# EAGLE design auto_resetter (EAGLE 7.3.0)
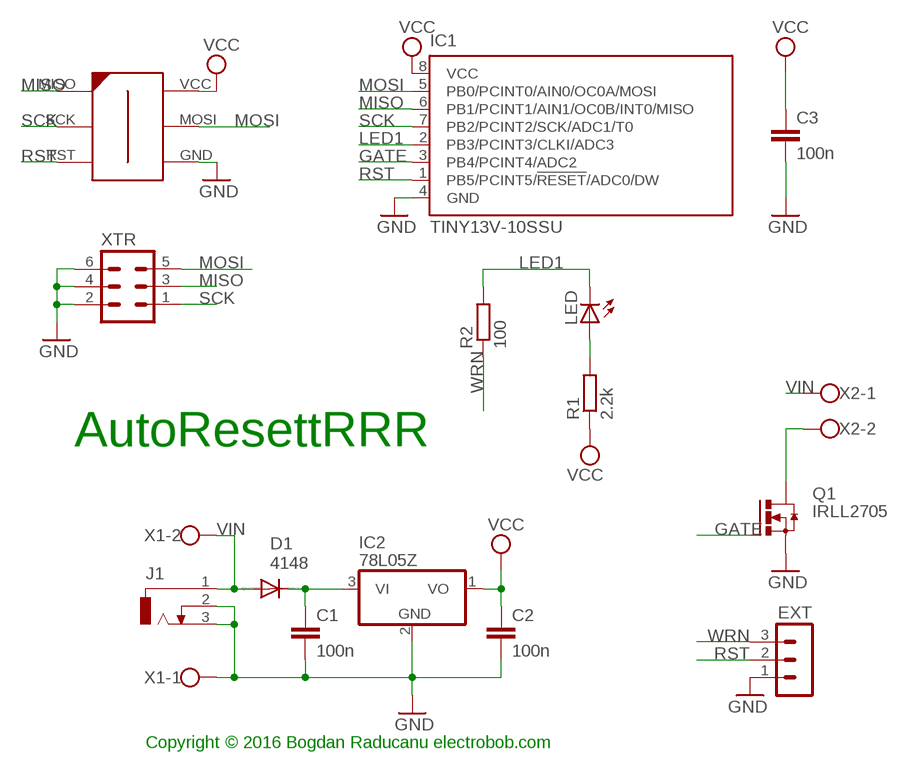
[diagram p0: schematic, sheet 1]

## Parts
C1  100n  C-EUC0805  [C0805]
C2  100n  C-EUC0805  [C0805]
C3  100n  C-EUC0805  [C0805]
D1  4148  DIODE-MINIMELF  [MINIMELF]
EXT  MA03-1  [MA03-1]
IC1  TINY13V-10SSU  [8S1]
IC2  78L05Z  [TO92]
J1  DCJ0303  [DCJ0303]
LED  LED3MM  [LED3MM]
Q1  IRLL2705  N-HEXFET-2D_SOT232-  [SOT223]
R1  2.2k  R-EU_M0805  [M0805]
R2  100  R-EU_M0805  [M0805]
U$1  AVR-ISP-6-EDGE  [6PAD_ISP]
X1  W237-102  [W237-102]
X2  W237-102  [W237-102]
XTR  MA03-2  [MA03-2]

## Nets
GATE: IC1.3(PB4/PCINT4/ADC2) Q1.1(G)
GND: C1.2 C2.2 C3.2 EXT.1 IC1.4(GND) IC2.2(GND) J1.2 J1.3 Q1.3(S) U$1.GND X1.1 XTR.2 XTR.4 XTR.6
LED1: IC1.2(PB3/PCINT3/CLKI/ADC3) LED.K(C) R2.2
MISO: IC1.6(PB1/PCINT1/AIN1/OC0B/INT0/MISO) U$1.MISO XTR.3
MOSI: IC1.5(PB0/PCINT0/AIN0/OC0A/MOSI) U$1.MOSI XTR.5
N$1: C1.1 D1.C IC2.3(VI)
N$2: LED.A R1.2
N$4: Q1.2(D) Q1.4(D) X2.2
RST: EXT.2 IC1.1(PB5/PCINT5/!RESET!/ADC0/DW) U$1.RST
SCK: IC1.7(PB2/PCINT2/SCK/ADC1/T0) U$1.SCK XTR.1
VCC: C2.1 C3.1 IC1.8(VCC) IC2.1(VO) R1.1 U$1.VCC
VIN: D1.A J1.1 X1.2 X2.1
WRN: EXT.3 R2.1

## Notes on the sheet
- AutoResettRRR
- Copyright © 2016 Bogdan Raducanu electrobob.com

## Library data of the parts
C1-C3 = rcl:C-EU: CAPACITOR, European symbol
D1 = diode:DIODE-: DIODE
EXT = con-lstb:MA03-1: PIN HEADER; OC_FARNELL: unknown; OC_NEWARK: unknown
IC1 = atmel:TINY13: 8-bit AVR Microcontroller with 1K Bytes In-System Programmable Flash Source: http://www.atmel.com/dyn/resources/prod_documents/2535S.pdf; MPN: ATTINY13V-10SSU; OC_FARNELL: 1455135; OC_NEWARK: 58M3773
IC2 = linear:78*: Positive VOLTAGE REGULATOR Source: http://cache.national.com/ds/LM/LM78L05.pdf http://www.fairchildsemi.com/ds/LM/LM7805.pdf
J1 = con-jack:DCJ0303: DC POWER JACK Source: DCJ0303.pdf; OC_FARNELL: unknown; OC_NEWARK: unknown
LED = led:LED: LED OSRAM: - CHIPLED LG R971, LG N971, LY N971, LG Q971, LY Q971, LO R971, LY R971 LH N974, LH R974 LS Q976, LO Q976, LY Q976 LO Q996 - Hyper CHIPLED LW Q18S LB Q993, LB Q99A, LB R99A - SideLED LS A670, LO A670, LY A670, LG A670, LP A670 LB A673, LV A673, LT A673, LW A673 LH A674 LY A675 LS A676, LA A676, LO A676, LY A676, LW A676 LS A679, LY A679, LG A679 - Hyper Micro SIDELED® LS Y876, LA Y876, LO Y876, LY Y876 LT Y87S - SmartLED LW L88C, LW L88S LB L89C, LB L89S, LG L890 LS L89K, LO L89K, LY L89K LS L896, LA L896, LO L896, LY L896 - TOPLED LS T670, LO T670, LY T670, LG T670, LP T670 LSG T670, LSP T670, LSY T670, LOP T670, LYG T670 LG T671, LOG T671, LSG T671 LB T673, LV T673, LT T673, LW T673 LH T674 LS T676, LA T676, LO T676, LY T676, LB T676, LH T676, LSB T676, LW T676 LB T67C, LV T67C, LT T67C, LS T67K, LO T67K, LY T67K, LW E67C LS E67B, LA E67B, LO E67B, LY E67B, LB E67C, LV E67C, LT E67C LW T67C LS T679, LY T679, LG T679 LS T770, LO T770, LY T770, LG T770, LP T770 LB T773, LV T773, LT T773, LW T773 LH T774 LS E675, LA E675, LY E675, LS T675 LS T776, LA T776, LO T776, LY T776, LB T776 LHGB T686 LT T68C, LB T68C - Hyper Mini TOPLED® LB M676 - Mini TOPLED Santana® LG M470 LS M47K, LO M47K, LY M47K Source: http://www.osram.convergy.de LUXEON: - LUMILED® LXK2-PW12-R00, LXK2-PW12-S00, LXK2-PW14-U00, LXK2-PW14-V00 LXK2-PM12-R00, LXK2-PM12-S00, LXK2-PM14-U00 LXK2-PE12-Q00, LXK2-PE12-R00, LXK2-PE12-S00, LXK2-PE14-T00, LXK2-PE14-U00 LXK2-PB12-K00, LXK2-PB12-L00, LXK2-PB12-M00, LXK2-PB14-N00, LXK2-PB14-P00, LXK2-PB14-Q00 LXK2-PR12-L00, LXK2-PR12-M00, LXK2-PR14-Q00, LXK2-PR14-R00 LXK2-PD12-Q00, LXK2-PD12-R00, LXK2-PD12-S00 LXK2-PH12-R00, LXK2-PH12-S00 LXK2-PL12-P00, LXK2-PL12-Q00, LXK2-PL12-R00 Source: www.luxeon.com KINGBRIGHT: KA-3528ASYC Source: www.kingbright.com
Q1 = transistor-power:N-HEXFET-2D_?-*: HEXFET® Power MOSFET 2 Drain connects http://www.irf.com/product-info/datasheets/data/irll014n.pdf
R1 R2 = rcl:R-EU_: RESISTOR, European symbol
U$1 = avr-7:AVR-ISP-6-EDGE: 6 pin edge connector for ISP with ATMEL MCUs. Developed by Craig Moates (craig at moates dot net). Library by David Blundell (blundar at gmail dot com). Often, even a 6 pin header is really inconvenient for board layout and/or production. This SMD-only header is our de-facto standard for using an edge connector for programming with the help of a 6pin/10pin to edge card adapter.
X1 X2 = con-wago-500:W237-102: WAGO SCREW CLAMP; MPN: 237-102; OC_FARNELL: unknown; OC_NEWARK: 70K9898
XTR = con-lstb:MA03-2: PIN HEADER; OC_FARNELL: unknown; OC_NEWARK: unknown

## Board
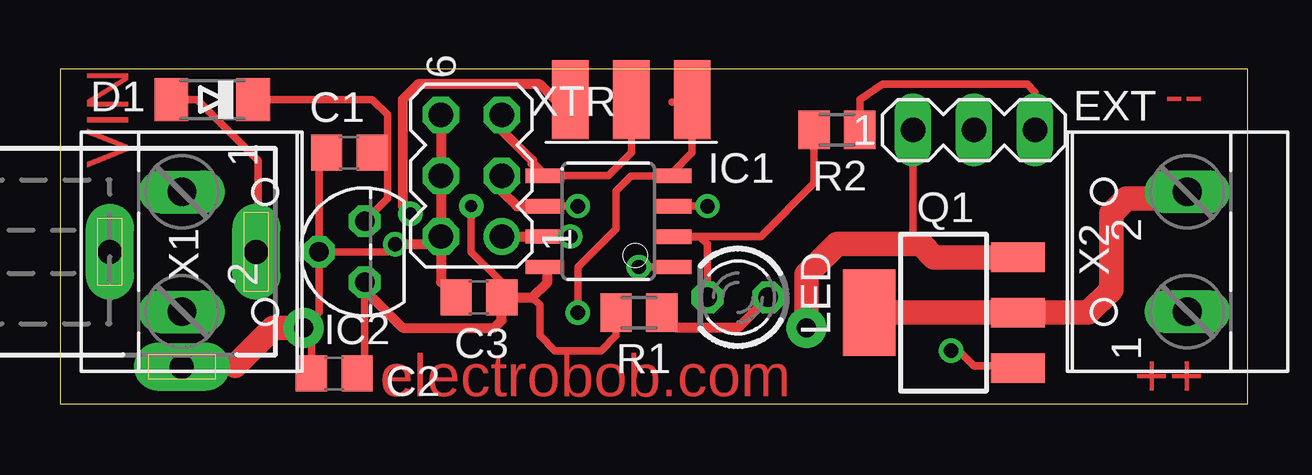
[diagram p1: board, top side]
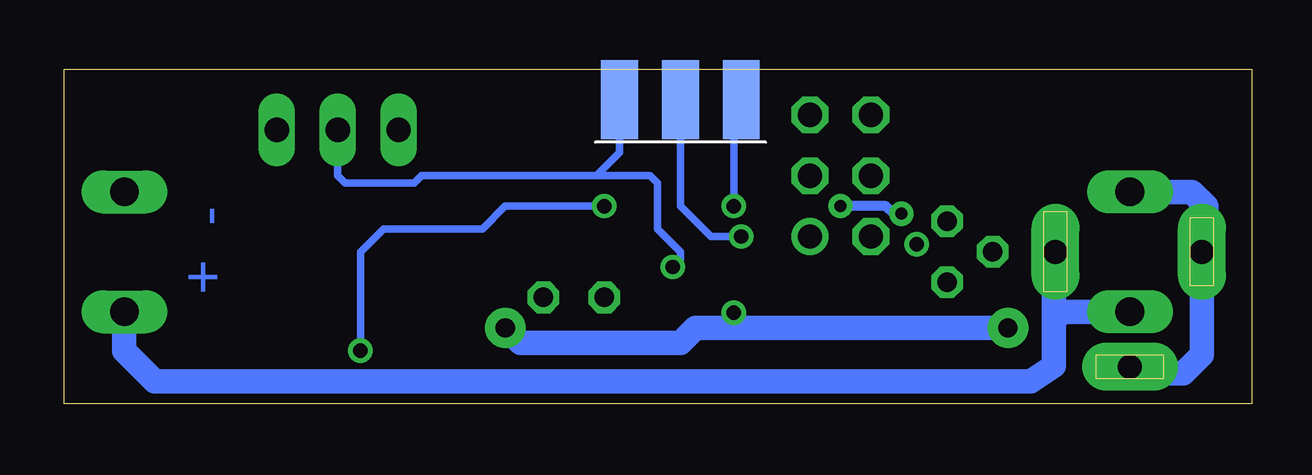
[diagram p2: board, bottom side, seen from below]

Size 49.5 x 13.96 mm. Coordinates in mm from the lower left corner, seen from the top.
Outline: 0,0 49.5,0 49.5,13.96 0,13.96 0,0
Copper layers (1*16): Top 0.035mm / dielectric 1.5mm / Bottom 0.035mm
Design rules "Elecrow_2-layer_eagle_rule": minimum track width 6mil, minimum drill 12mil, track to track 6mil, track to pad 6mil, pad to pad 6mil, via to via 6mil, smd to smd 0mil, copper to edge 10mil, drill to drill 10mil, minimum pad ring 10mil, minimum via ring 6mil, stop-mask expansion 2mil, vias tented up to drill 100mil, thermal gap 10mil

### Footprints (pad centres in the part's own frame; a part is rotated, then mirrored left to right if it is on the bottom)
C0805 = smd 1.3 x 1.5: 1 -0.95,0; 2 0.95,0
MINIMELF = smd 1.4 x 1.8: A 1.7,0; C -1.7,0
MA03-1 = drill 1.016 long: 1 -2.54,0; 2 0,0; 3 2.54,0
8S1 = smd 0.6 x 1.6: 1 -1.905,-2.654; 2 -0.645,-2.654; 3 0.625,-2.654; 4 1.895,-2.654; 5 1.905,2.654; 6 0.635,2.654; 7 -0.635,2.654; 8 -1.905,2.654
TO92 = drill 0.813 octagon: 1 -1.27,0; 2 0,1.905; 3 1.27,0
DCJ0303 = drill 1 pad 2 long: 1 0,3.1; 2 4.8,0; 3 0,-3
LED3MM = drill 0.813 octagon: A -1.27,0; K 1.27,0
SOT223 = smd 1.219 x 2.235: 1 -2.311,-3.099; 2 0,-3.099; 3 2.311,-3.099 | smd 3.6 x 2.2: 4 0,3.099
M0805 = smd 1.3 x 1.6: 1 -0.95,0; 2 0.95,0
6PAD_ISP = smd 1.524 x 3.302 bottom: GND 2.54,0; MOSI 0,0; VCC -2.54,0 | smd 1.524 x 3.302: MISO -2.54,0; RST 2.54,0; SCK 0,0
W237-102 = drill 1.194 long: 1 -2.5,-1.27; 2 2.5,-1.27
MA03-2 = drill 1.016: 1 -2.54,-1.27 | drill 1.016 octagon: 2 -2.54,1.27; 3 0,-1.27; 4 0,1.27; 5 2.54,-1.27; 6 2.54,1.27

### Placement (x,y rotation side)
C1  12.06,10.48 180 top
C2  11.43,1.27 180 top
C3  17.46,4.45 180 top
D1  6.35,12.7 180 top
EXT  38.1,11.43 0 top
IC1  22.86,7.62 90 top
IC2  12.7,6.35 90 top
J1  5.08,6.35 270 top
LED  28.26,4.45 180 top
Q1  36.83,3.81 90 top
R1  24.13,3.81 0 top
R2  32.38,11.43 180 top
U$1  23.81,12.7 180 bottom
X1  6.35,6.35 270 top
X2  45.72,6.35 90 top
XTR  17.14,9.53 90 top

### Tracks (layer width: path | path; a pad name or v marks a point on that pad's centre or on a via)
GATE  (via drill 0.6 pad 1.02)
  Top 0.305: v26.99,8.26 25.52,8.26 IC1.3 | v37.15,2.22 37.47,2.22 38.1,1.59 39.84,1.59 Q1.1
  Bottom 0.305: v26.99,8.26 31.11,8.26 32.07,7.3 36.2,7.3 37.15,6.35 v37.15,2.22
GND  (via drill 0.6 pad 1.02, 0.8 pad 1.68)
  Top 0.305: IC2.2 10.79,10.47 C1.2 | IC2.2 10.79,3.81 v10.16,3.17 10.48,2.85 C2.2 | IC2.2 13.65,6.35 v13.97,6.67 | 25.51,12.59 U$1.GND 26.35,10.48 25.51,9.64 IC1.4 23.8,9.52 23.18,8.89 23.18,7.3 21.59,5.71 v21.59,3.81 | EXT.1 35.56,6.99 35.88,6.67
  Top 0.406: XTR.6 XTR.4 XTR.2 | v13.97,6.67 15.56,6.67 XTR.2 | XTR.2 15.88,5.08 C3.2
  Top 0.813: 31.11,3.49 v31.11,3.17 | 7.3,1.59 5.12,1.59 J1.2
  Top 1.016: Q1.3 36.42,6.12 35.88,6.67 32.38,6.67 31.11,5.4 31.11,3.49 | v10.16,3.17 8.89,3.17 7.3,1.59
  Bottom 0.305: v21.59,3.81 21.59,3.17
  Bottom 0.813: 1.91,6.53 J1.3 | 5.71,1.27 5.36,1.27 J1.2
  Bottom 1.016: X1.1 2.5,8.85 1.91,8.26 1.91,6.53 | J1.3 2.08,2.05 2.86,1.27 5.71,1.27 | v31.11,3.17 30.48,2.54 23.81,2.54 23.18,3.17 21.59,3.17 v10.16,3.17
LED1
  Top 0.305: IC1.2 26.04,6.97 | 26.04,6.97 26.68,6.97 26.99,6.67 LED.K | R2.2 31.43,9.21 29.21,6.99 26.05,6.99 26.04,6.97
MISO  (via drill 0.6 pad 1.02)
  Top 0.305: IC1.6 v21.59,8.26
  Top 0.406: XTR.3 18.41,8.89 19.05,8.26 IC1.6
  Bottom 0.305: v21.59,8.26 21.59,11.43 U$1.MISO
MOSI
  Top 0.305: IC1.5 21.91,9.53 22.86,9.53 23.81,10.48 U$1.MOSI
  Top 0.406: XTR.5 18.41,11.43 19.68,10.16 19.68,10.05 IC1.5
N$1
  Top 0.305: D1.C 13.02,12.7 13.65,12.06 13.65,10.47 | 13.65,10.47 13.65,11.12 | 13.65,11.12 C1.1 13.65,10.47 | IC2.3 13.65,8.57 13.65,10.47 | 13.65,10.47 13.65,11.12 | 13.65,11.12 13.65,10.47
N$2
  Top 0.406: LED.A 28.26,3.17 25.71,3.17 R1.2
N$4
  Top 0.813: 46.71,8.57 X2.2
  Top 1.016: 46.71,8.57 44.45,8.57 43.81,7.94 43.81,4.76 42.86,3.81 Q1.2 Q1.4
RST  (via drill 0.6 pad 1.02)
  Top 0.305: v24.13,5.71 IC1.1
  Bottom 0.305: 23.81,6.03 v24.13,5.71 23.81,6.03 | 27.3,9.53 34.61,9.53 34.92,9.21 37.78,9.21 38.1,9.53 EXT.2 | 27.3,9.53 26.35,10.48 U$1.RST | 27.3,9.53 25.08,9.53 24.77,9.21 24.77,7.3 23.81,6.35 23.81,6.03
SCK  (via drill 0.6 pad 1.02)
  Top 0.305: v21.27,6.99 IC1.7
  Top 0.406: XTR.1 IC1.7
  Bottom 0.305: v21.27,6.99 22.54,6.99 22.86,7.3 23.81,8.26 U$1.SCK
VCC  (via drill 0.5 pad 1.02)
  Top 0.305: IC2.1 12.7,1.59 C2.1 | R1.1 23.18,2.86 22.54,2.22 20.64,2.22 20,2.86 20,4.13 19.68,4.45 | C3.1 18.41,5.08 17.14,6.35 v17.14,8.26
  Top 0.406: IC2.1 12.7,4.76 14.29,3.17 18.1,3.17 18.41,3.49 C3.1 19.68,4.45 20.32,5.08 20.32,5.6 IC1.8 | U$1.VCC 20.64,12.7 20,13.34 14.92,13.34 14.29,12.7 14.29,8.26 v14.61,7.94
  Bottom 0.406: v14.61,7.94 14.92,7.94 15.24,8.26 v17.14,8.26
VIN
  Top 0.305: D1.A 5.71,12.7 8.26,10.16 8.26,6.42 J1.1
  Bottom 0.813: 8.26,6.28 J1.1
  Bottom 1.016: X2.1 46.99,2.22 45.72,0.95 9.21,0.95 8.26,1.59 8.26,3.49 | 8.26,3.49 8.26,6.28 | X1.2 7.9,3.85 8.26,3.49
WRN
  Top 0.305: EXT.3 40.64,13.02 40.32,13.34 34.29,13.34 33.34,12.7 R2.1

### Text on the board
Top: -- | VIN | electrobob.com | ++
Bottom: - | +